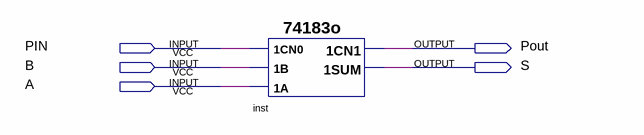
[diagram p0: schematic sheet]
// Quartus schematic lab3_5.bdf as structural Verilog: 1 symbols, 5 pins
module lab3_5 (
  input  PIN,
  input  B,
  input  A,
  output Pout,
  output S
);

  \74183o  inst (.\1CN0 (PIN), .\1A (A), .\1B (B), .\1CN1 (Pout), .\1SUM (S));
endmodule
